# Altium schematic sheet A_PITCHROLL.schdoc
size 242 x 186 mm
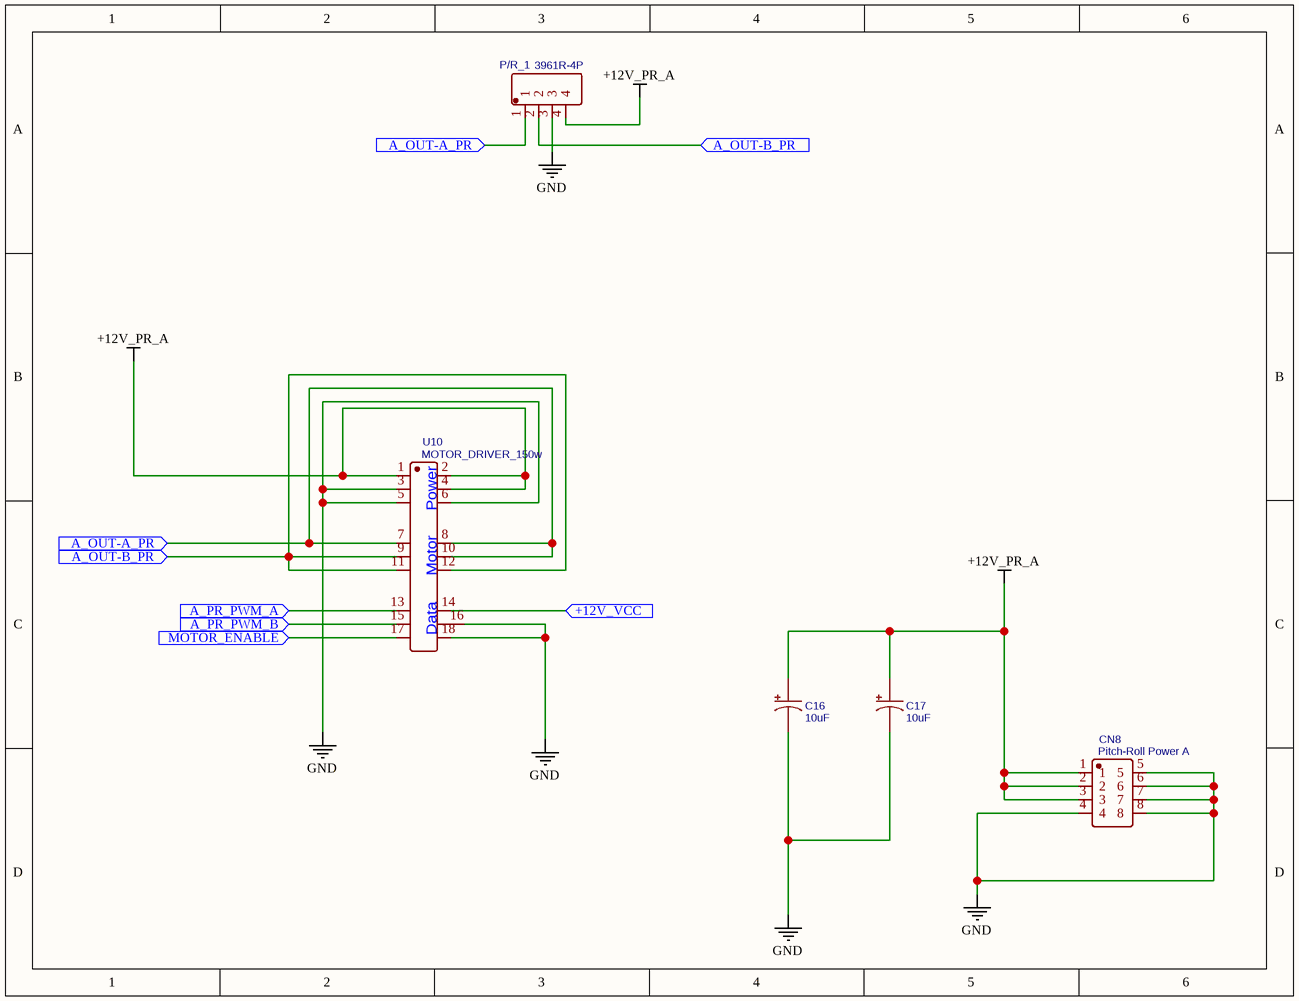
[diagram p0: A_PITCHROLL.schdoc]

## Parts
C16  10uF  [CAP-SMD_BD4.0-L4.3-W4.3-FD]
C17  10uF  [CAP-SMD_BD4.0-L4.3-W4.3-FD]
CN8  Pitch-Roll Power A  [CONN-TH_8P-P4.20_X9357WV-2-04-N2SN]
P/R_1  3961R-4P  [CONN-TH_4P-P3.96_3961R-4P]
U10  MOTOR_DRIVER_150w  [MOTOR_DRIVE_150W_MODULE]

## Ports
+12V_VCC (in), A_OUT-A_PR (in), A_OUT-B_PR (in), A_PR_PWM_A (in), A_PR_PWM_B (in), MOTOR_ENABLE (in)

## Nets
+12V_PR_A: C16.1 C17.1 CN8.1 CN8.2 CN8.3 P/R_1.4 U10.1(+12V_YAW) U10.2(+12V_YAW) U10.4(+12V_YAW)
GND: C16.2 C17.2 CN8.4 CN8.5 CN8.6 CN8.7 CN8.8 P/R_1.3 U10.3(GND) U10.5(GND) U10.6(GND) U10.16(GND) U10.18(GND)
+12V_VCC: U10.14(+12V_VCC) ; port +12V_VCC
A_OUT-A_PR: P/R_1.1 U10.7(OUT-A_YAW) U10.8(OUT-A_YAW) U10.10(OUT-A_YAW) ; port A_OUT-A_PR
A_OUT-B_PR: P/R_1.2 U10.9(OUT-B_YAW) U10.11(OUT-B_YAW) U10.12(OUT-B_YAW) ; port A_OUT-B_PR
A_PR_PWM_A: U10.13(PWM-A_YAW) ; port A_PR_PWM_A
A_PR_PWM_B: U10.15(PWM-B_YAW) ; port A_PR_PWM_B
MOTOR_ENABLE: U10.17(MOTOR_ENABLE) ; port MOTOR_ENABLE

## Notes on the sheet
- (in symbol MOTOR_DRIVER_150w) Power; Motor; Data

## Library data of the parts
C16 C17 = 10uF: BOM_Manufacturer: ROQANG; BOM_Manufacturer Part: VT1E100M0405; nameAlias: Capacitance; Contributor: LCSC; BOM_Supplier: LCSC; BOM_Supplier Part: C213486; BOM_JLCPCB Part Class: Extended Part; JLCPCB Part Class: Extended Part; spicePre: C; spiceSymbolName: VT1E100M0405
CN8 = Pitch-Roll Power A: BOM_Manufacturer: XKB Enterprise; BOM_Manufacturer Part: X9357WV-2*04-N2SN; Contributor: LCSC; BOM_Supplier: LCSC; BOM_Supplier Part: C519240; BOM_JLCPCB Part Class: Extended Part; spicePre: C; spiceSymbolName: X9357WV-2*04-N2SN
P/R_1 = 3961R-4P: BOM_Manufacturer: Ckmtw; Contributor: LCSC; BOM_Supplier: LCSC; BOM_Manufacturer Part: 3961R-4P; BOM_Supplier Part: C138427; BOM_JLCPCB Part Class: Extended Part; spicePre: C; spiceSymbolName: 3961R-4P
U10 = MOTOR_DRIVER_150w: Contributor: digitalman; spicePre: U; spiceSymbolName: MOTOR_DRIVER_150w